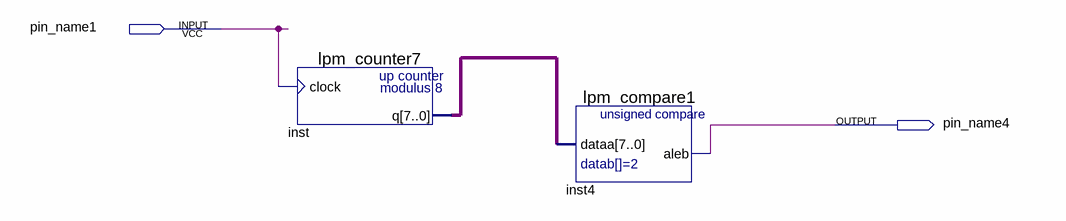
[diagram p0: schematic sheet]
// Quartus schematic Block2.bdf as structural Verilog: 2 symbols, 2 pins
module Block2 (
  input  pin_name1,
  output pin_name4
);

  wire [7:0] inst_q;

  lpm_counter7 inst (.clock(pin_name1), .q(inst_q));
  lpm_compare1 inst4 (.dataa(inst_q), .aleb(pin_name4));
endmodule
